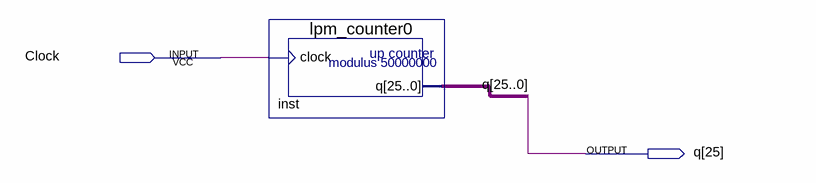
[diagram p0: schematic sheet]
// Quartus schematic Divisor50MHZ.bdf as structural Verilog: 1 symbols, 2 pins
module Divisor50MHZ (
  input  Clock,
  output [25:0] q
);

  lpm_counter0 inst (.clock(Clock), .q(q));
endmodule
